# EAGLE schematic irdroid_secure (EAGLE 6.5.0)
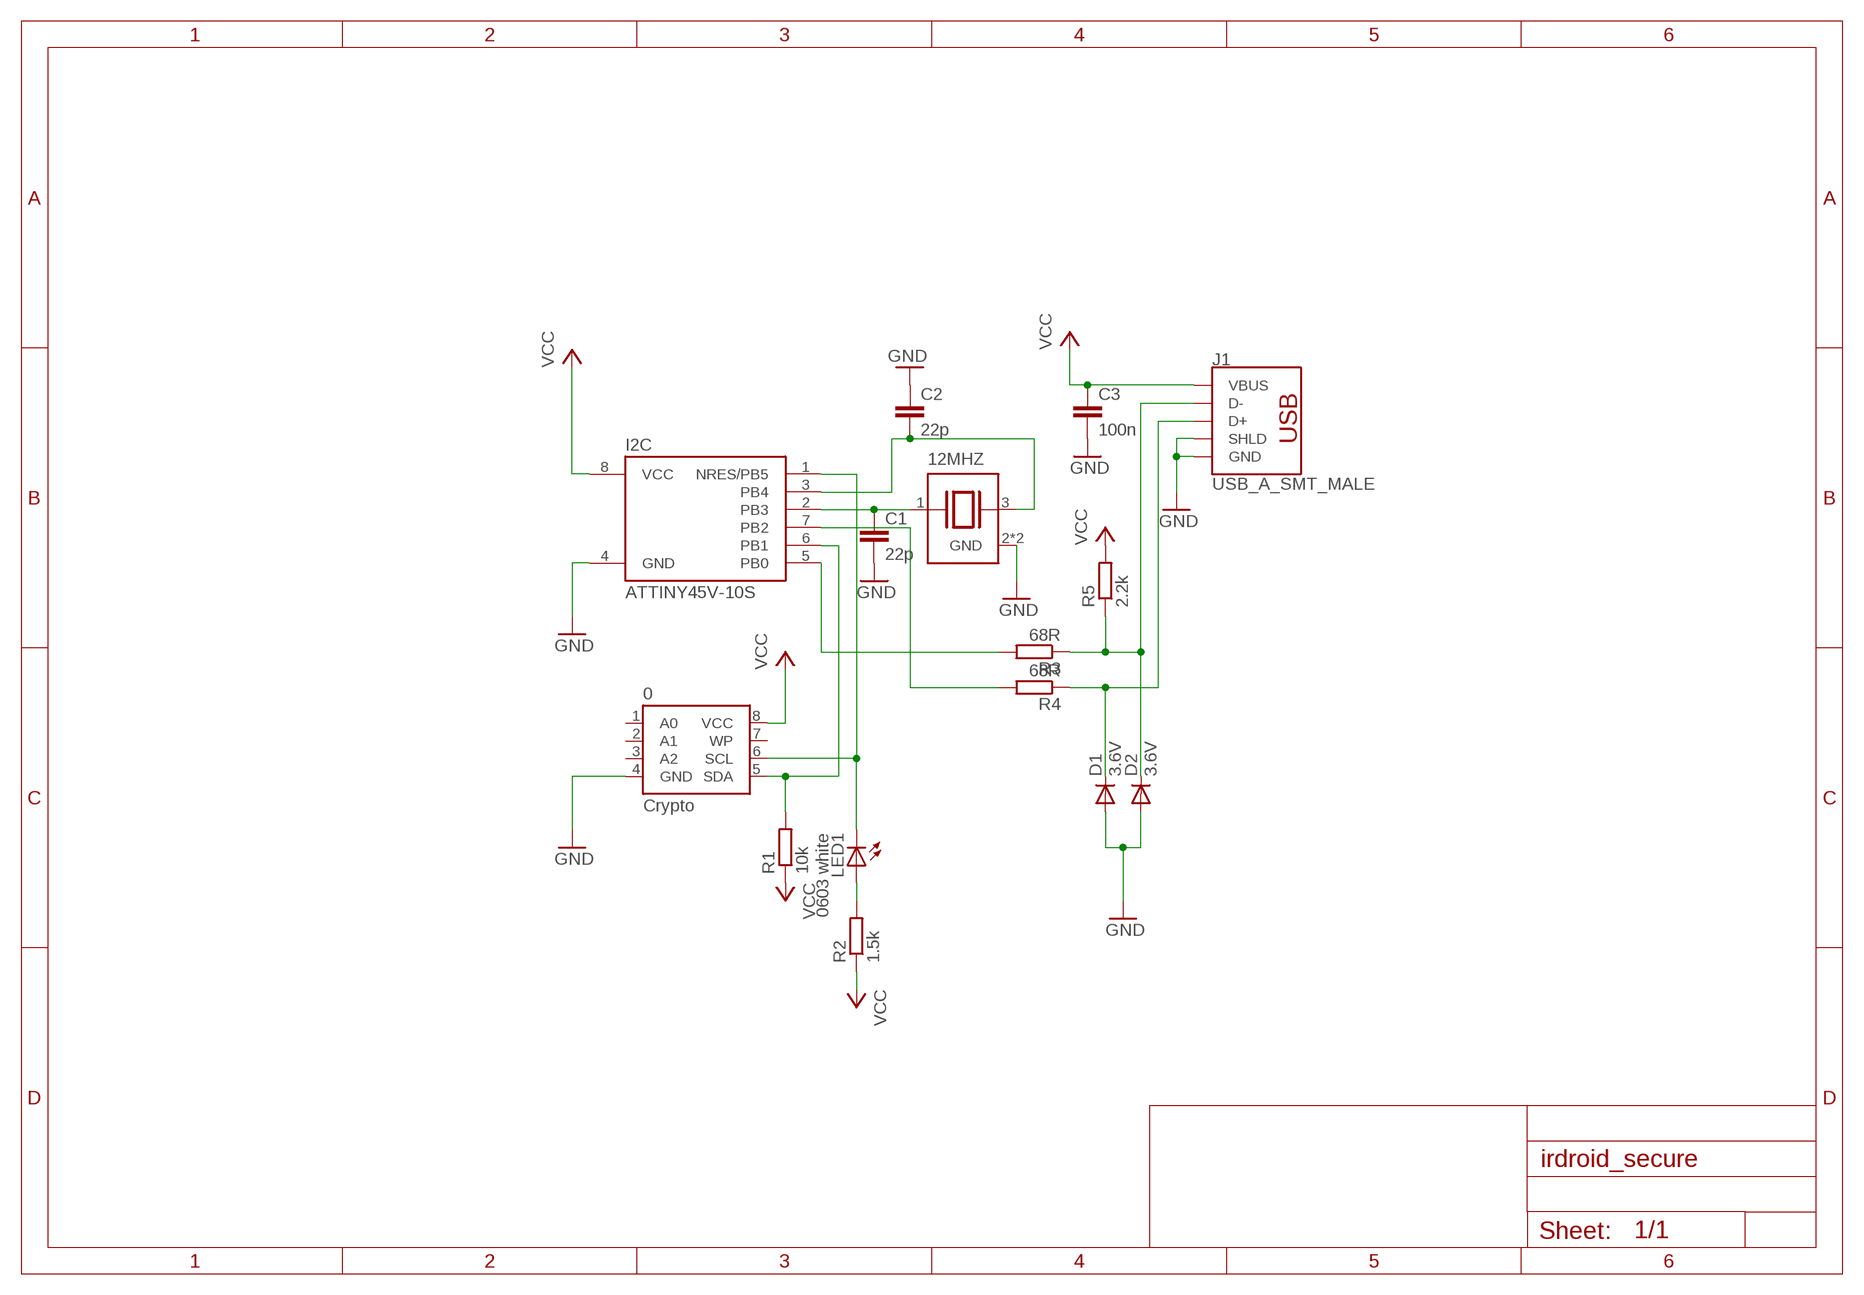
[diagram p0: schematic, sheet 1]

## Parts
0  Crypto  EEPROM-I2C256K  [SO08]
12MHZ  ABM8-16.000MHZ-B2-T  [XTAL_ABM8-16.000MHZ-B2-T]
C1  22p  C-EUC0603  [C0603]
C2  22p  C-EUC0603  [C0603]
C3  100n  C-EUC0603  [C0603]
D1  3.6V  DIODE-SOD323-R  [SOD323-R]
D2  3.6V  DIODE-SOD323-R  [SOD323-R]
I2C  ATTINY45V-10S  [SOIC8_EIAJ_208MIL]
J1  USB_A_SMT_MALE  [USB-A-SMT-MALE]
LED1  0603 white  LEDCHIP-LED0603  [CHIP-LED0603]
R1  10k  R-EU_R0603  [R0603]
R2  1.5k  R-EU_R0603  [R0603]
R3  68R  R-EU_R0603  [R0603]
R4  68R  R-EU_R0603  [R0603]
R5  2.2k  R-EU_R0603  [R0603]

## Nets
GND: 0.4(GND) 12MHZ.2(GND) 12MHZ.4(GND) C1.2 C2.1 C3.2 D1.A D2.A I2C.4(GND) J1.GND1(GND) J1.SHLD1(SHLD) J1.SHLD2(SHLD)
N$1: 12MHZ.1 C1.1 I2C.2(PB3)
N$2: 12MHZ.3 C2.2 I2C.3(PB4)
N$3: 0.5(SDA) I2C.6(PB1) R1.2
N$4: 0.6(SCL) I2C.1(NRES/PB5) LED1.C
N$5: I2C.5(PB0) R3.2
N$6: I2C.7(PB2) R4.2
N$7: D2.C J1.D-1(D-) R3.1 R5.1
N$8: LED1.A R2.2
N$10: D1.C J1.D+1(D+) R4.1
VCC: 0.8(VCC) C3.1 I2C.8(VCC) J1.VBUS1(VBUS) R1.1 R2.1 R5.2
Unconnected: 0.1(A0) 0.2(A1) 0.3(A2) 0.7(WP)

## Library data of the parts
0 = SparkFun-IC-Memory:EEPROM-I2C: I2C EEPROMs, 24LC256 and others 24LC256 Series 256 kb I2C 2 Wire (32 k x 8 Bit) 2.5 V Serial EEPROM SMD - SOIC-8 Datasheet SparkFun Products SparkFun UDB5 - PIC UAV Development Board <https://www.sparkfun.com/products/11703> (GPS-11703); PROD_ID: IC-09714; VALUE: 24LC256
12MHZ = ABM8-16.000MHZ-B2-T:ABM8-16.000MHZ-B2-T: Check availability <https://pricing.snapeda.com/parts/ABM8-16.000MHZ-B2-T/Abracon/view-part?ref=eda>; AVAILABILITY: In Stock; DESCRIPTION: 16 MHz ±20ppm Crystal 18pF 70 Ohms 4-SMD, No Lead; MF: Abracon; MP: ABM8-16.000MHZ-B2-T; PACKAGE: SMD-4 Abracon; PRICE: None; PURCHASE-URL: https://pricing.snapeda.com/search/part/ABM8-16.000MHZ-B2-T/?ref=eda
C1-C3 = resistor:C-EU: CAPACITOR, European symbol
D1 D2 = diode:DIODE-: DIODE
I2C = _hhn_attiny25_45_85:ATTINY45*: ATMEL ATtiny 45 Packages: P = PDIP 08 30mil S = SOIC 08 EIAJ 208mil X = TSSOP 08 4.4mm Technologies Note: for complete ordering code (temp. range, finish, tape&reel etc.) see www.atmel.com • Supply Voltage: V = (1.8…5.5)V | [blank] = (2.7…5.5)V • Speed: 10 = 10 MHz | 20 = 20 MHz Author: Dipl.-Ing. FH Rainer Bayer HHN Hochschule Heilbronn (Heilbronn University), rainer.bayer@hs-heilbronn.de Ingenieurbüro ing-rb, mail@ing-rb.de
J1 = SparkFun-Connectors:USB_A: USB-A Connector Male and female variants, as well as PTH and SMT variants SparkFun Products: SparkFun XBee Explorer Dongle <https://www.sparkfun.com/products/11697> PTH Male SparkFun MicroView-USB Programmer <https://www.sparkfun.com/products/12924> SMT Male SparkFun USB Type A Female Breakout <https://www.sparkfun.com/products/12700> SMT Female; PROD_ID: CONN-11499
LED1 = led:LED: LED OSRAM: - CHIPLED LG R971, LG N971, LY N971, LG Q971, LY Q971, LO R971, LY R971 LH N974, LH R974 LS Q976, LO Q976, LY Q976 LO Q996 - Hyper CHIPLED LW Q18S LB Q993, LB Q99A, LB R99A - SideLED LS A670, LO A670, LY A670, LG A670, LP A670 LB A673, LV A673, LT A673, LW A673 LH A674 LY A675 LS A676, LA A676, LO A676, LY A676, LW A676 LS A679, LY A679, LG A679 - Hyper Micro SIDELED® LS Y876, LA Y876, LO Y876, LY Y876 LT Y87S - SmartLED LW L88C, LW L88S LB L89C, LB L89S, LG L890 LS L89K, LO L89K, LY L89K LS L896, LA L896, LO L896, LY L896 - TOPLED LS T670, LO T670, LY T670, LG T670, LP T670 LSG T670, LSP T670, LSY T670, LOP T670, LYG T670 LG T671, LOG T671, LSG T671 LB T673, LV T673, LT T673, LW T673 LH T674 LS T676, LA T676, LO T676, LY T676, LB T676, LH T676, LSB T676, LW T676 LB T67C, LV T67C, LT T67C, LS T67K, LO T67K, LY T67K, LW E67C LS E67B, LA E67B, LO E67B, LY E67B, LB E67C, LV E67C, LT E67C LW T67C LS T679, LY T679, LG T679 LS T770, LO T770, LY T770, LG T770, LP T770 LB T773, LV T773, LT T773, LW T773 LH T774 LS E675, LA E675, LY E675, LS T675 LS T776, LA T776, LO T776, LY T776, LB T776 LHGB T686 LT T68C, LB T68C - Hyper Mini TOPLED® LB M676 - Mini TOPLED Santana® LG M470 LS M47K, LO M47K, LY M47K Source: http://www.osram.convergy.de LUXEON: - LUMILED® LXK2-PW12-R00, LXK2-PW12-S00, LXK2-PW14-U00, LXK2-PW14-V00 LXK2-PM12-R00, LXK2-PM12-S00, LXK2-PM14-U00 LXK2-PE12-Q00, LXK2-PE12-R00, LXK2-PE12-S00, LXK2-PE14-T00, LXK2-PE14-U00 LXK2-PB12-K00, LXK2-PB12-L00, LXK2-PB12-M00, LXK2-PB14-N00, LXK2-PB14-P00, LXK2-PB14-Q00 LXK2-PR12-L00, LXK2-PR12-M00, LXK2-PR14-Q00, LXK2-PR14-R00 LXK2-PD12-Q00, LXK2-PD12-R00, LXK2-PD12-S00 LXK2-PH12-R00, LXK2-PH12-S00 LXK2-PL12-P00, LXK2-PL12-Q00, LXK2-PL12-R00 Source: www.luxeon.com KINGBRIGHT: KA-3528ASYC Source: www.kingbright.com
R1-R5 = resistor:R-EU_: RESISTOR, European symbol